# Altium project LM-003.PrjPcb (part 1 of 2)
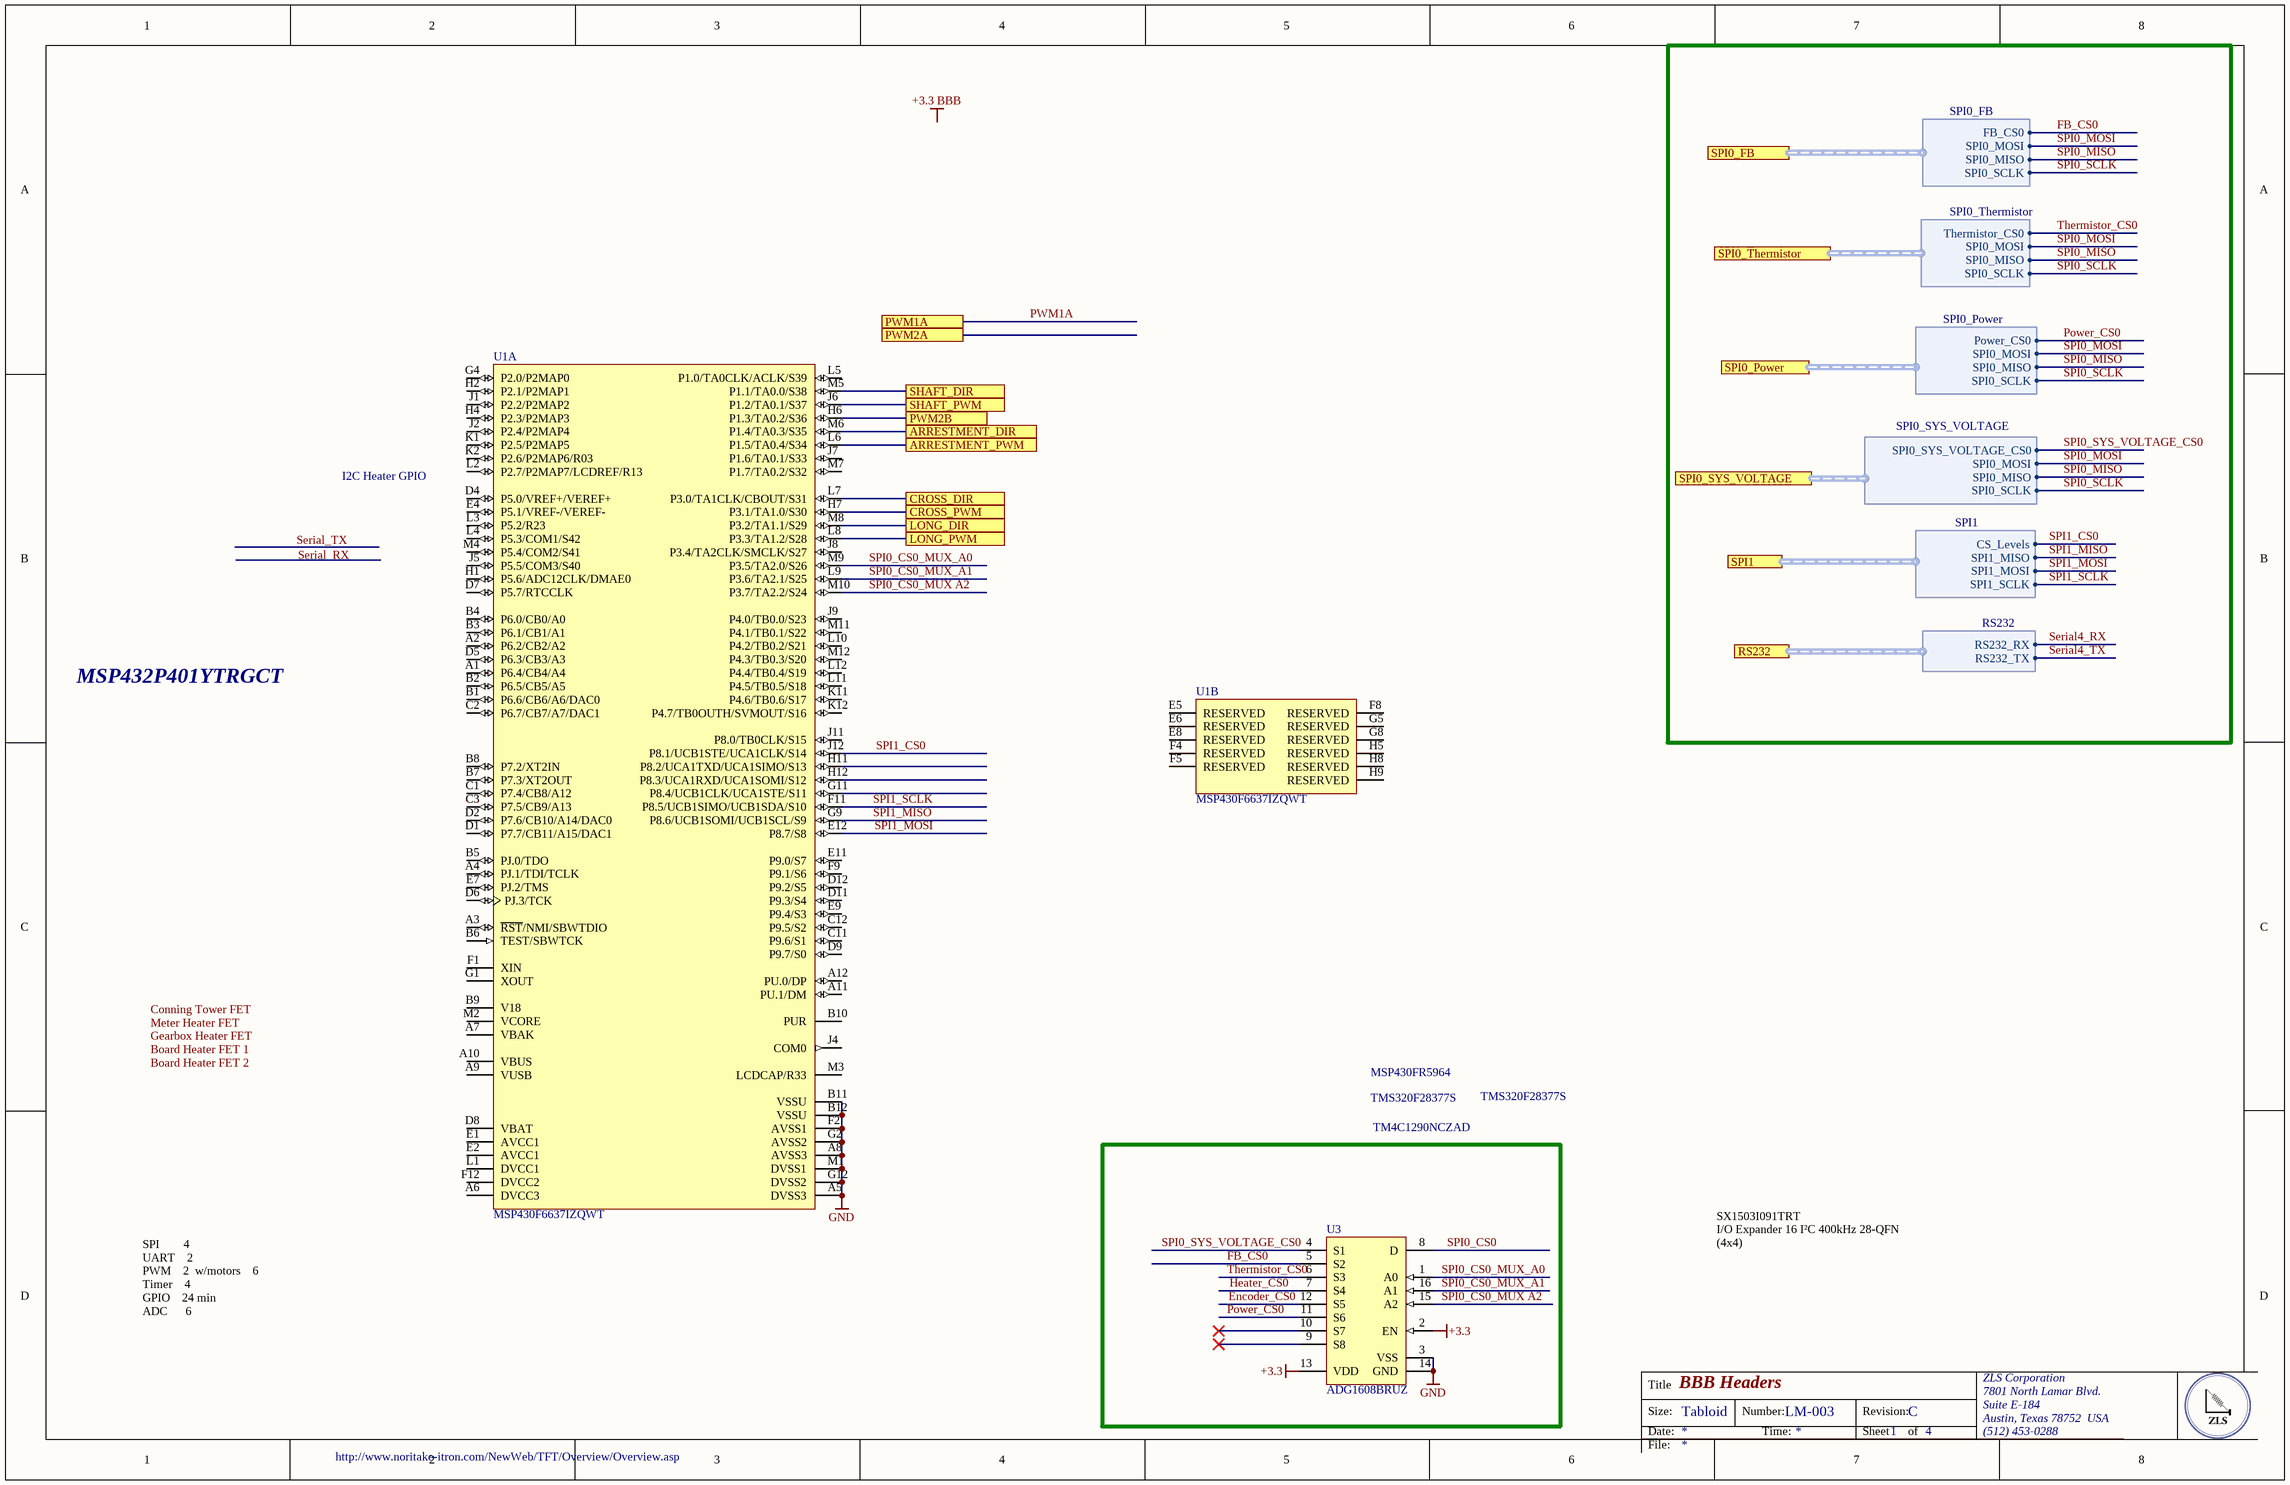
[diagram p0: MCU.SchDoc]
6 sheets, 53 parts. Net scope: flat (ports and power ports of the same name join across sheets).
Board file: LM-003.PcbDoc
Sheets:
  MCU.SchDoc
  Connectors.SchDoc
  System_Supply.SchDoc
  12_Supply.SchDoc
  36V_HV_Supply.SchDoc
  Power_Input_FET.SchDoc

## Sheet MCU.SchDoc: BBB Headers
size Tabloid; DocumentNumber: LM-003; Revision: C; SheetNumber: 1; SheetTotal: 4

### Parts
U1  MSP430F6637IZQWT  [TI-ZQW113]  (parts A,B of 2)
U3  ADG1608BRUZ  [ADI-RU-16_M]

### Blocks framed on the sheet
TM4C1290NCZAD: U3

### Ports
ARRESTMENT_DIR, ARRESTMENT_PWM, CROSS_DIR, CROSS_PWM, LONG_DIR, LONG_PWM, PWM1A, PWM2A, PWM2B, RS232 (harness RS232), SHAFT_DIR, SHAFT_PWM, SPI0_FB (harness SPI0_FB), SPI0_Power (harness SPI0_Power), SPI0_SYS_VOLTAGE (harness SPI0_SYS_VOLTAGE), SPI0_Thermistor (harness SPI0_Thermistor), SPI1 (harness SPI1)

### Harnesses
RS232: RS232_RX, RS232_TX
SPI1: CS_Levels, SPI1_MISO, SPI1_MOSI, SPI1_SCLK
SPI0_Power: Power_CS0, SPI0_MOSI, SPI0_MISO, SPI0_SCLK
SPI0_Thermistor: Thermistor_CS0, SPI0_MOSI, SPI0_MISO, SPI0_SCLK
SPI0_FB: FB_CS0, SPI0_MOSI, SPI0_MISO, SPI0_SCLK
SPI0_SYS_VOLTAGE: SPI0_SYS_VOLTAGE_CS0, SPI0_MOSI, SPI0_MISO, SPI0_SCLK

### Nets
+3.3: U3.2(EN) U3.13(VDD)
GND: U1.A5(DVSS3) U1.A8(AVSS3) U1.B11(VSSU) U1.B12(VSSU) U1.F2(AVSS1) U1.G2(AVSS2) U1.G12(DVSS2) U1.M1(DVSS1) U3.3(VSS) U3.14(GND)
Encoder_CS0: U3.12(S5)
FB_CS0: U3.5(S2) ; port SPI0_FB.FB_CS0
Heater_CS0: U3.7(S4)
Power_CS0: U3.11(S6) ; port SPI0_Power.Power_CS0
PWM2B: U1.H6(P1.3/TA0.2/S36) ; port PWM2B
Serial4_RX: port RS232.RS232_RX
Serial4_TX: port RS232.RS232_TX
SPI0_CS0: U3.8(D)
SPI0_CS0_MUX A2: U1.M10(P3.7/TA2.2/S24) U3.15(A2)
SPI0_CS0_MUX_A0: U1.M9(P3.5/TA2.0/S26) U3.1(A0)
SPI0_CS0_MUX_A1: U1.L9(P3.6/TA2.1/S25) U3.16(A1)
SPI0_MISO: port SPI0_Power.SPI0_MISO, port SPI0_Thermistor.SPI0_MISO, port SPI0_FB.SPI0_MISO, port SPI0_SYS_VOLTAGE.SPI0_MISO
SPI0_MOSI: port SPI0_Power.SPI0_MOSI, port SPI0_Thermistor.SPI0_MOSI, port SPI0_FB.SPI0_MOSI, port SPI0_SYS_VOLTAGE.SPI0_MOSI
SPI0_SCLK: port SPI0_Power.SPI0_SCLK, port SPI0_Thermistor.SPI0_SCLK, port SPI0_FB.SPI0_SCLK, port SPI0_SYS_VOLTAGE.SPI0_SCLK
SPI0_SYS_VOLTAGE_CS0: U3.4(S1) ; port SPI0_SYS_VOLTAGE.SPI0_SYS_VOLTAGE_CS0
SPI1_CS0: U1.J12(P8.1/UCB1STE/UCA1CLK/S14) ; port SPI1.CS_Levels
SPI1_MISO: U1.G9(P8.6/UCB1SOMI/UCB1SCL/S9) ; port SPI1.SPI1_MISO
SPI1_MOSI: U1.E12(P8.7/S8) ; port SPI1.SPI1_MOSI
SPI1_SCLK: U1.F11(P8.5/UCB1SIMO/UCB1SDA/S10) ; port SPI1.SPI1_SCLK
Thermistor_CS0: U3.6(S3) ; port SPI0_Thermistor.Thermistor_CS0
NetU1_H7: U1.H7(P3.1/TA1.0/S30) ; port CROSS_PWM
NetU1_J6: U1.J6(P1.2/TA0.1/S37) ; port SHAFT_PWM
NetU1_L6: U1.L6(P1.5/TA0.4/S34) ; port ARRESTMENT_PWM
NetU1_L7: U1.L7(P3.0/TA1CLK/CBOUT/S31) ; port CROSS_DIR
NetU1_L8: U1.L8(P3.3/TA1.2/S28) ; port LONG_PWM
NetU1_M5: U1.M5(P1.1/TA0.0/S38) ; port SHAFT_DIR
NetU1_M6: U1.M6(P1.4/TA0.3/S35) ; port ARRESTMENT_DIR
NetU1_M8: U1.M8(P3.2/TA1.1/S29) ; port LONG_DIR

Not connected (* = marked no-connect by the designer): U1 A1(P6.4/CB4/A4) A2(P6.2/CB2/A2) A3(~{RST}/NMI/SBWTDIO) A4(PJ.1/TDI/TCLK) A6(DVCC3) A7(VBAK) A9(VUSB) A10(VBUS) A11(PU.1/DM) A12(PU.0/DP) B1(P6.6/CB6/A6/DAC0) B2(P6.5/CB5/A5) B3(P6.1/CB1/A1) B4(P6.0/CB0/A0) B5(PJ.0/TDO) B6(TEST/SBWTCK) B7(P7.3/XT2OUT) B8(P7.2/XT2IN) B9(V18) B10(PUR) C1(P7.4/CB8/A12) C2(P6.7/CB7/A7/DAC1) C3(P7.5/CB9/A13) C11(P9.6/S1) C12(P9.5/S2) D1(P7.7/CB11/A15/DAC1) D2(P7.6/CB10/A14/DAC0) D4(P5.0/VREF+/VEREF+) D5(P6.3/CB3/A3) D6(PJ.3/TCK) D7(P5.7/RTCCLK) D8(VBAT) D9(P9.7/S0) D11(P9.3/S4) D12(P9.2/S5) E1(AVCC1) E2(AVCC1) E4(P5.1/VREF-/VEREF-) E5(RESERVED) E6(RESERVED) E7(PJ.2/TMS) E8(RESERVED) E9(P9.4/S3) E11(P9.0/S7) F1(XIN) F4(RESERVED) F5(RESERVED) F8(RESERVED) F9(P9.1/S6) F12(DVCC2) G1(XOUT) G4(P2.0/P2MAP0) G5(RESERVED) G8(RESERVED) G11(P8.4/UCB1CLK/UCA1STE/S11) H1(P5.6/ADC12CLK/DMAE0) H2(P2.1/P2MAP1) H4(P2.3/P2MAP3) H5(RESERVED) H8(RESERVED) H9(RESERVED) H11(P8.2/UCA1TXD/UCA1SIMO/S13) H12(P8.3/UCA1RXD/UCA1SOMI/S12) J1(P2.2/P2MAP2) J2(P2.4/P2MAP4) J4(COM0) J5(P5.5/COM3/S40) J7(P1.6/TA0.1/S33) J8(P3.4/TA2CLK/SMCLK/S27) J9(P4.0/TB0.0/S23) J11(P8.0/TB0CLK/S15) K1(P2.5/P2MAP5) K2(P2.6/P2MAP6/R03) K11(P4.6/TB0.6/S17) K12(P4.7/TB0OUTH/SVMOUT/S16) L1(DVCC1) L2(P2.7/P2MAP7/LCDREF/R13) L3(P5.2/R23) L4(P5.3/COM1/S42) L5(P1.0/TA0CLK/ACLK/S39) L10(P4.2/TB0.2/S21) L11(P4.5/TB0.5/S18) L12(P4.4/TB0.4/S19) M2(VCORE) M3(LCDCAP/R33) M4(P5.4/COM2/S41) M7(P1.7/TA0.2/S32) M11(P4.1/TB0.1/S22) M12(P4.3/TB0.3/S20); U3 9(S8)* 10(S7)*

### Notes on the sheet
- I2C Heater GPIO
- MSP432P401YTRGCT
- MSP430FR5964
- TMS320F28377S
- SX1503I091TRT
  I/O Expander 16 I²C 400kHz 28-QFN (4x4)
- SPI        4
  UART    2
  PWM    2  w/motors    6
  Timer    4
  GPIO    24 min
  ADC      6
- http://www.noritake-itron.com/NewWeb/TFT/Overview/Overview.asp
- Labels drawn without touching a wire or pin: +3.3 BBB, Board Heater FET 1, Board Heater FET 2, Conning Tower FET, Gearbox Heater FET, Meter Heater FET, Serial_RX, Serial_TX
- Title
- Size:
- Date:
- Tabloid
- Number:
- Time:
- Revision:
- Sheet
- of
- ZLS Corporation
- 7801 North Lamar Blvd.
- Suite E-184
- Austin, Texas 78752  USA
- (512) 453-0288
- File:

### Library data of the parts
U1 = CMP-0365-01413-1: 20 MHz Mixed Signal Microcontroller with 192 KB Flash, 16384 B SRAM and 74 GPIOs, -40 to 85 degC, 113-pin BGA (ZQW), Green (RoHS & no Sb/Br); Manufacturer: Texas Instruments; Frequency(MHz): 20; Brown Out Reset: Yes; Real-Time Clock: Yes, with battery backup; DMA: 3; ADC Channels: 16; Timers - 16-bit: 4; DAC: 2; ADC: 12-bit SAR; SRAM(B): 16384; GPIO: 74; Multiplier: 32x32; Flash(KB): 192; USB: 1; SubFamily: 6 Series with LCD; Eco-Plan: Green (RoHS & no Sb/Br); ComponentLink3URL: http://www.ti.com/lit/ml/mpbg674/mpbg674.pdf; PackageReference: ZQW113; PackageVersion: 4204599-3/D; ComponentLink2Description: Datasheet; Watchdog: Yes; ComponentLink1Description: Manufacturer URL; ComponentLink2URL: http://www.ti.com/general/docs/lit/getliterature.tsp?genericPartNumber=MSP430F6637&fileType=pdf; PartNumber: MSP430F6637IZQWT; Temp Sensor: Yes; Code_JEDEC: MO-225; USCI_B (I2C & SPI): 2; ComponentLink1URL: http://www.ti.com/; SVS: Yes; DatasheetVersion: SLAS566C; ComponentLink3Description: Package Specification; PackageDescription: 113-Pin Plastic Ball Grid Array Package, Body 7 x 7 mm, Pitch 0.5 mm; USCI_A (UART/LIN/IrDA/SPI): 2; Mounting Technology: Surface Mount; Comparators: Yes; PartId: 1
U3 = CMP-0793-00136-1: 4.5 Ohm Ron, 8-Channel +/-5 V,+12 V, +5 V and +3.3 V Multiplexer, 16-pin SOP (RU-16), Tube; Manufacturer: Analog Devices Inc.; Multiplexer/Demultiplexer Circuit: 8:1; On-State Resistance (Max): 4.5 Ohm; Channel-to-Channel Matching (&Delta;Ron): 120 mOhm; Voltage - Supply, Single (V+): 3.3 V ~ 16 V; Voltage - Supply, Dual (V±): ±3.3 V ~ 8 V; Switch Time (Ton, Toff) (Max): 94ns, 93ns; -3db Bandwidth: 40MHz; Charge Injection: 29pC; Channel Capacitance (CS(off), CD(off)): 19pF, 117pF; Current - Leakage (IS(off)) (Max): 100pA; Crosstalk: -64dB @ 1MHz; Supplier 1: Digi-Key; Supplier Part Number 1: ADG1608BRUZ-ND; Manufacturer Part Number: ADG1608BRUZ; RoHS: RoHS Compliant; Category: Integrated Circuits (ICs); Stock 1: 1151; Pricing 1: 1=9.31, 96=8.01552, 192=6.95979, 576=6.0605 (USD); Packaging: Tube; Part Status: Active; Switch Circuit: -; Operating Temperature: -40°C ~ 125°C (TA); Package / Case: 16-TSSOP (0.173", 4.40mm Width); Supplier Device Package: 16-TSSOP; Base Part Number: ADG1608; ComponentLink1URL: http://www.analog.com/media/en/technical-documentation/data-sheets/ADG1608_1609.pdf; ComponentLink1Description: http://www.analog.com/media/en/technical-documentation/data-sheets/ADG1608_1609.pdf

## Sheet Connectors.SchDoc: Connectors
size OrCAD A; DocumentNumber: LM-003; Revision: C; SheetNumber: 2; SheetTotal: 4
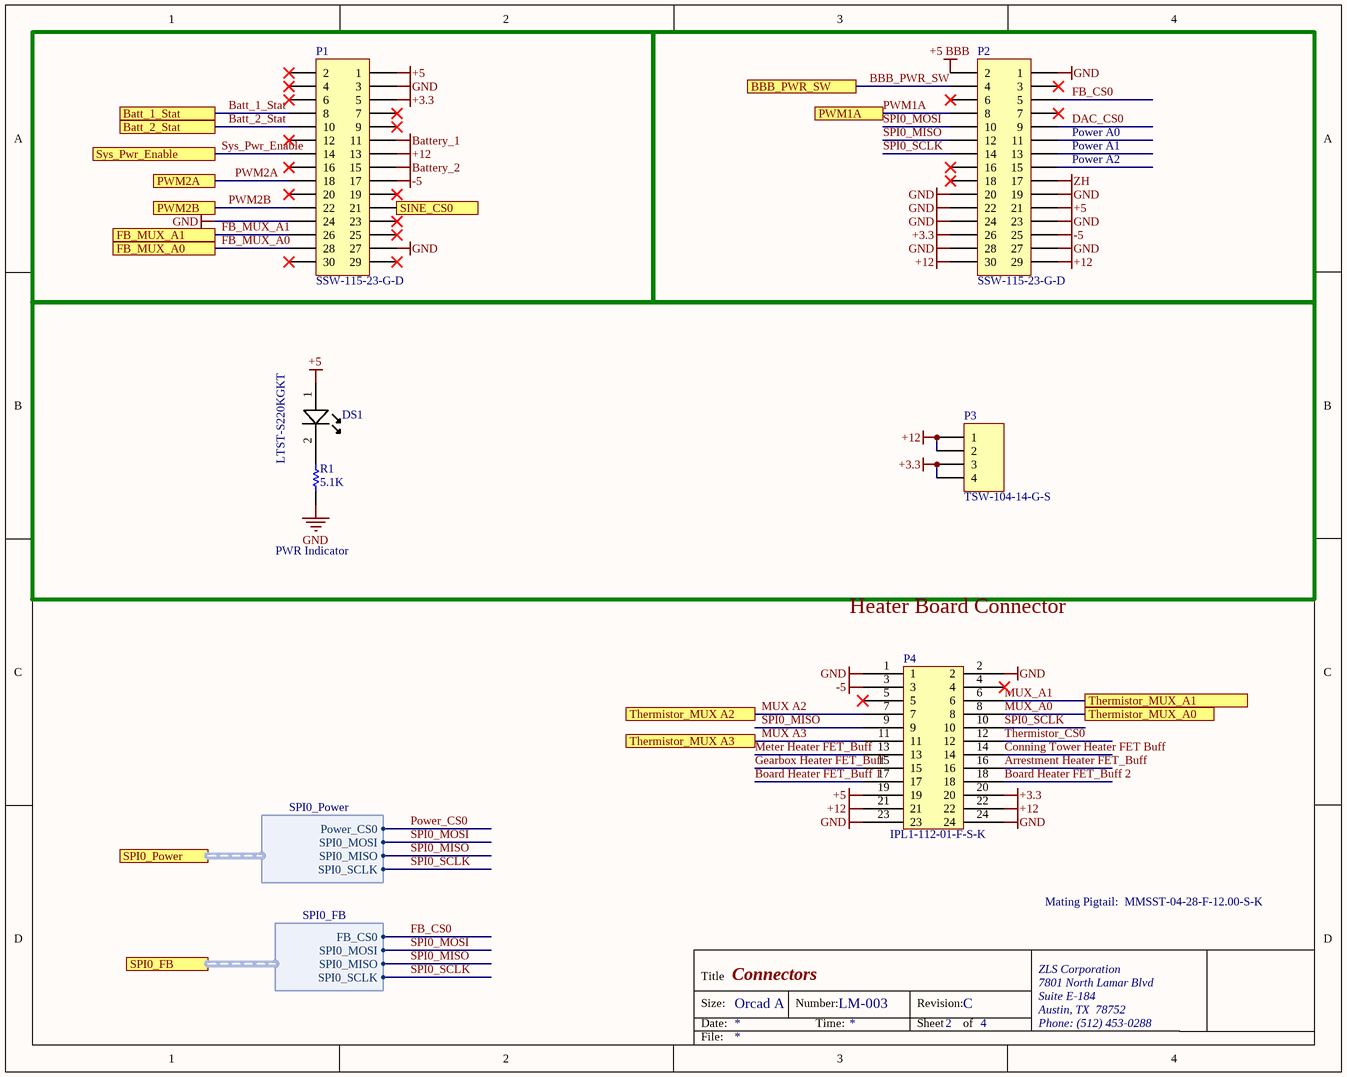
[diagram p1: Connectors.SchDoc]

### Parts
DS1  Manufacturer Part Number: LTST-S220KGKT  [0805C_L]  (hidden comment: Lite-On LTST-S220KGKT Green LED, 571 nm 2012 (0805) Side View, Rectangle Lens SMD package)
P1  SSW-115-23-G-D  [SSW-115-23-G-D]
P2  SSW-115-23-G-D  [SSW-115-23-G-D]
P3  TSW-104-14-G-S  [HDR1X4]
P4  IPL1-112-01-F-S-K  [IPL1-112-01-F-S-K]
R1  5.1K  [RESC0805(2012)_L]

### Blocks framed on the sheet
PWR Indicator: DS1 P3 R1

### Ports
Batt_1_Stat, Batt_2_Stat, BBB_PWR_SW, FB_MUX_A0, FB_MUX_A1, PWM1A, PWM2A, PWM2B, SINE_CS0, SPI0_FB (harness SPI0_FB), SPI0_Power (harness SPI0_Power), Sys_Pwr_Enable, Thermistor_MUX A2, Thermistor_MUX A3, Thermistor_MUX_A0, Thermistor_MUX_A1

### Harnesses
SPI0_FB: FB_CS0, SPI0_MOSI, SPI0_MISO, SPI0_SCLK
SPI0_Power: Power_CS0, SPI0_MOSI, SPI0_MISO, SPI0_SCLK

### Nets
+3.3: P1.5 P2.26 P3.3 P3.4 P4.20
+5: DS1.1(A) P1.1 P2.21 P4.19
+5 BBB: P2.2
+12: P1.13 P2.29 P2.30 P3.1 P3.2 P4.21 P4.22
-5: P1.17 P2.25 P4.3
Battery_1: P1.11
Battery_2: P1.15
GND: P1.3 P1.24 P1.27 P2.1 P2.19 P2.20 P2.22 P2.23 P2.24 P2.27 P2.28 P4.1 P4.2 P4.23 P4.24 R1.2
ZH: P2.17
Arrestment Heater FET_Buff: P4.16
Batt_1_Stat: P1.8 ; port Batt_1_Stat
Batt_2_Stat: P1.10 ; port Batt_2_Stat
BBB_PWR_SW: P2.4 ; port BBB_PWR_SW
Board Heater FET_Buff 1: P4.17
Board Heater FET_Buff 2: P4.18
Conning Tower Heater FET Buff: P4.14
DAC_CS0: P2.9
FB_CS0: P2.5 ; port SPI0_FB.FB_CS0
FB_MUX_A0: P1.28 ; port FB_MUX_A0
FB_MUX_A1: P1.26 ; port FB_MUX_A1
Gearbox Heater FET_Buff: P4.15
Meter Heater FET_Buff: P4.13
MUX A2: P4.7 ; port Thermistor_MUX A2
MUX A3: P4.11 ; port Thermistor_MUX A3
MUX_A0: P4.8 ; port Thermistor_MUX_A0
MUX_A1: P4.6 ; port Thermistor_MUX_A1
PWM1A: P2.8 ; port PWM1A
PWM2A: P1.18 ; port PWM2A
PWM2B: P1.22 ; port PWM2B
SPI0_MISO: P2.12 P4.9 ; port SPI0_FB.SPI0_MISO, port SPI0_Power.SPI0_MISO
SPI0_MOSI: P2.10 ; port SPI0_FB.SPI0_MOSI, port SPI0_Power.SPI0_MOSI
SPI0_SCLK: P2.14 P4.10 ; port SPI0_FB.SPI0_SCLK, port SPI0_Power.SPI0_SCLK
Sys_Pwr_Enable: P1.14 ; port Sys_Pwr_Enable
Thermistor_CS0: P4.12
NetDS1_2: DS1.2(K) R1.1
NetP1_21: P1.21 ; port SINE_CS0

Not connected (* = marked no-connect by the designer): P1 2* 4* 6* 7* 9* 12* 16* 19* 20* 23* 25* 29* 30*; P2 3* 6* 7* 11 13 15 16* 18*; P4 4* 5*

### Notes on the sheet
- (near P2) Power A0
- (near P2) Power A1
- (near P2) Power A2
- Heater Board Connector
- Mating Pigtail:  MMSST-04-28-F-12.00-S-K
- Title
- Size:
- Date:
- Orcad A
- Number:
- Time:
- Revision:
- Sheet
- of
- ZLS Corporation
- 7801 North Lamar Blvd
- Suite E-184
- Austin, TX  78752
- Phone: (512) 453-0288
- File:

### Library data of the parts
DS1 = LED A/K: Manufacturer: Vishay / Lite-On; Lens Colour: Colorless; Viewing Angle: 130°; Luminous Intensity: 35mcd; Forward Current: 20mA; Forward Voltage: 2V; Lens Style: Diffused,Colorless; Power Rating: 75mW; Dominant Wavelength: 568nm; Lens Transparency: Clear; Number of Elements: 1; Power Dissipation: 75W; Wavelength: 574nm; Supplier 1: Digi-Key; Supplier Part Number 1: 160-1468-1-ND; Stock 1: 74800; Pricing 1: 1=0.29, 10=0.212, 25=0.1564, 100=0.1117, 250=0.0759, 500=0.067, 1000=0.0525 (USD); Mount: Surface Mount; Case/Package: 0805; Number of Pins: 2; Colour: Green; Case Code (Metric): 2012; Case Code (Imperial): 0805; Min Operating Temperature: -55°C; Max Operating Temperature: 85°C; Packaging: Tape and Reel; Package Quantity: 4000; Illumination Colour: Green; Test Current: 20mA; Number of LEDs: 1; Length: 2.1mm; Height: 0.6mm; Width: 1mm; Depth: 0.6mm; Radiation Hardening: No; Lead Free: Lead Free; ComponentLink1URL: https://datasheet.ciiva.com/11775/0900766b80dc0b70-11775441.pdf; ComponentLink1Description: https://datasheet.ciiva.com/11775/0900766b80dc0b70-11775441.pdf; ComponentLink2URL: https://datasheet.ciiva.com/2110/s-110-ltst-s220kgkt-2110069.pdf; ComponentLink2Description: https://datasheet.ciiva.com/2110/s-110-ltst-s220kgkt-2110069.pdf; ComponentLink3URL: https://datasheet.ciiva.com/2110/s-110-ltst-s220kgkt-2110070.pdf; ComponentLink3Description: https://datasheet.ciiva.com/2110/s-110-ltst-s220kgkt-2110070.pdf; ComponentLink4URL: https://datasheet.ciiva.com/12400/100-ltst-s220kgkt-59602-12400886.pdf; ComponentLink4Description: https://datasheet.ciiva.com/12400/100-ltst-s220kgkt-59602-12400886.pdf; ComponentLink5URL: https://datasheet.ciiva.com/2110/s-110-ltst-s220kgkt-2110071.pdf; ComponentLink5Description: https://datasheet.ciiva.com/2110/s-110-ltst-s220kgkt-2110071.pdf; ComponentLink6URL: https://datasheet.ciiva.com/16379/ltst-s220kgkt-16379082.pdf; ComponentLink6Description: https://datasheet.ciiva.com/16379/ltst-s220kgkt-16379082.pdf
P1 P2 = Header 15X2: Header, 15-Pin, Dual row; Manufacturer: Samtec Inc.; Connector Type: Receptacle; Style: Board to Board or Cable; Number of Positions: 30; Number of Positions Loaded: All; Pitch - Mating: 0.100" (2.54mm); Contact Length - Post: 0.394" (10.00mm); Material Flammability Rating: UL94 V-0; Current Rating: 5.7A per Contact; Supplier 1: Digi-Key; Supplier Part Number 1: SSW-115-23-G-D-ND; Manufacturer Part Number: SSW-115-23-G-D; RoHS: RoHS Compliant; Category: Connectors, Interconnects; Stock 1: 0; Pricing 1: 1=5.3 (USD); Packaging: Bulk; Part Status: Active; Contact Type: Forked; Row Spacing - Mating: 0.100" (2.54mm); Mounting Type: Through Hole; Termination: Solder; Fastening Type: Push-Pull; Contact Finish - Mating: Gold; Contact Finish Thickness - Mating: 20.0µin (0.51µm); Insulation Color: Black; Insulation Height: 0.335" (8.51mm); Operating Temperature: -55°C ~ 125°C; Contact Finish - Post: Gold; Mated Stacking Heights: -; Ingress Protection: -; Features: -; Voltage Rating: -; Applications: -; Insulation Material: Liquid Crystal Polymer (LCP); Contact Shape: Square; Contact Material: Phosphor Bronze; Contact Finish Thickness - Post: 3.00µin (0.076µm)
P3 = Header 4: Header, 4-Pin; Manufacturer: Samtec Inc.; Pitch - Mating: 0.100" (2.54mm); Number of Positions: 4; Number of Positions Loaded: All; Style: Board to Board or Cable; Shrouding: Unshrouded; Contact Length - Mating: 0.320" (8.13mm); Contact Length - Post: 0.110" (2.79mm); Overall Contact Length: 0.530" (13.46mm); Material Flammability Rating: UL94 V-0; Supplier 1: Digi-Key; Supplier Part Number 1: SAM1053-04-ND; Manufacturer Part Number: TSW-104-14-G-S; RoHS: RoHS Compliant; Category: Connectors, Interconnects; Stock 1: 278; Pricing 1: 1=1.02, 10=0.915, 100=0.7537, 500=0.59578, 1000=0.51143, 5000=0.46657, 10000=0.44863 (USD); Packaging: Bulk; Part Status: Active; Connector Type: Header; Contact Type: Male Pin; Number of Rows: 1; Row Spacing - Mating: -; Mounting Type: Through Hole; Termination: Solder; Fastening Type: Push-Pull; Insulation Height: 0.100" (2.54mm); Contact Shape: Square; Contact Finish - Mating: Gold; Contact Finish Thickness - Mating: 10.0µin (0.25µm); Contact Finish - Post: Gold; Contact Material: Phosphor Bronze; Insulation Material: Polybutylene Terephthalate (PBT); Features: -; Operating Temperature: -55°C ~ 125°C; Ingress Protection: -; Insulation Color: Black; Current Rating: -; Voltage Rating: -; Mated Stacking Heights: -; Contact Finish Thickness - Post: 3.00µin (0.076µm); Applications: -; ComponentLink1URL: http://suddendocs.samtec.com/prints/tsw-xxx-xx-xxx-x-xx-xxx-mkt.pdf; ComponentLink1Description: http://suddendocs.samtec.com/prints/tsw-xxx-xx-xxx-x-xx-xxx-mkt.pdf
P4 = IPL1-112-01-F-S-K: IPL1-112-01-F-D-K; Manufacturer: Samtec Inc.; Supplier 1: Digi-Key; Supplier Part Number 1: IPL1-112-01-F-S-K-ND; Manufacturer Part Number: IPL1-112-01-F-S-K; RoHS: RoHS Compliant; Category: Connectors, Interconnects; Stock 1: 0; Pricing 1: 1=2.63 (USD); Part Status: Active
R1 = CMP-1013-00215-1: RES SMD 5.1K OHM 5% 1/8W 0805; Manufacturer: Vishay Dale; Manufacturer Part Number: CRCW08055K10JNEA; Power (Watts): 0.125W, 1/8W; Temperature Coefficient: ±200ppm/°C; Supplier 1: Digi-Key; Supplier Part Number 1: 541-5.1KACT-ND; RoHS: RoHS Compliant; Category: Resistors; Stock 1: 429; Pricing 1: 1=0.1, 10=0.044, 100=0.0178, 1000=0.00802, 2500=0.00696 (USD); Packaging: Cut Tape (CT); Part Status: Active; Tolerance: ±5%; Composition: Thick Film; Features: Automotive AEC-Q200; Operating Temperature: -55°C ~ 155°C; Package / Case: 0805 (2012 Metric); Supplier Device Package: 0805; Size / Dimension: 0.079" L x 0.049" W (2.00mm x 1.25mm); Height - Seated (Max): 0.020" (0.50mm); Failure Rate: -; ComponentLink1URL: http://www.vishay.com/docs/20035/dcrcwe3.pdf; ComponentLink1Description: http://www.vishay.com/docs/20035/dcrcwe3.pdf

## Sheet System_Supply.SchDoc
size OrCAD A
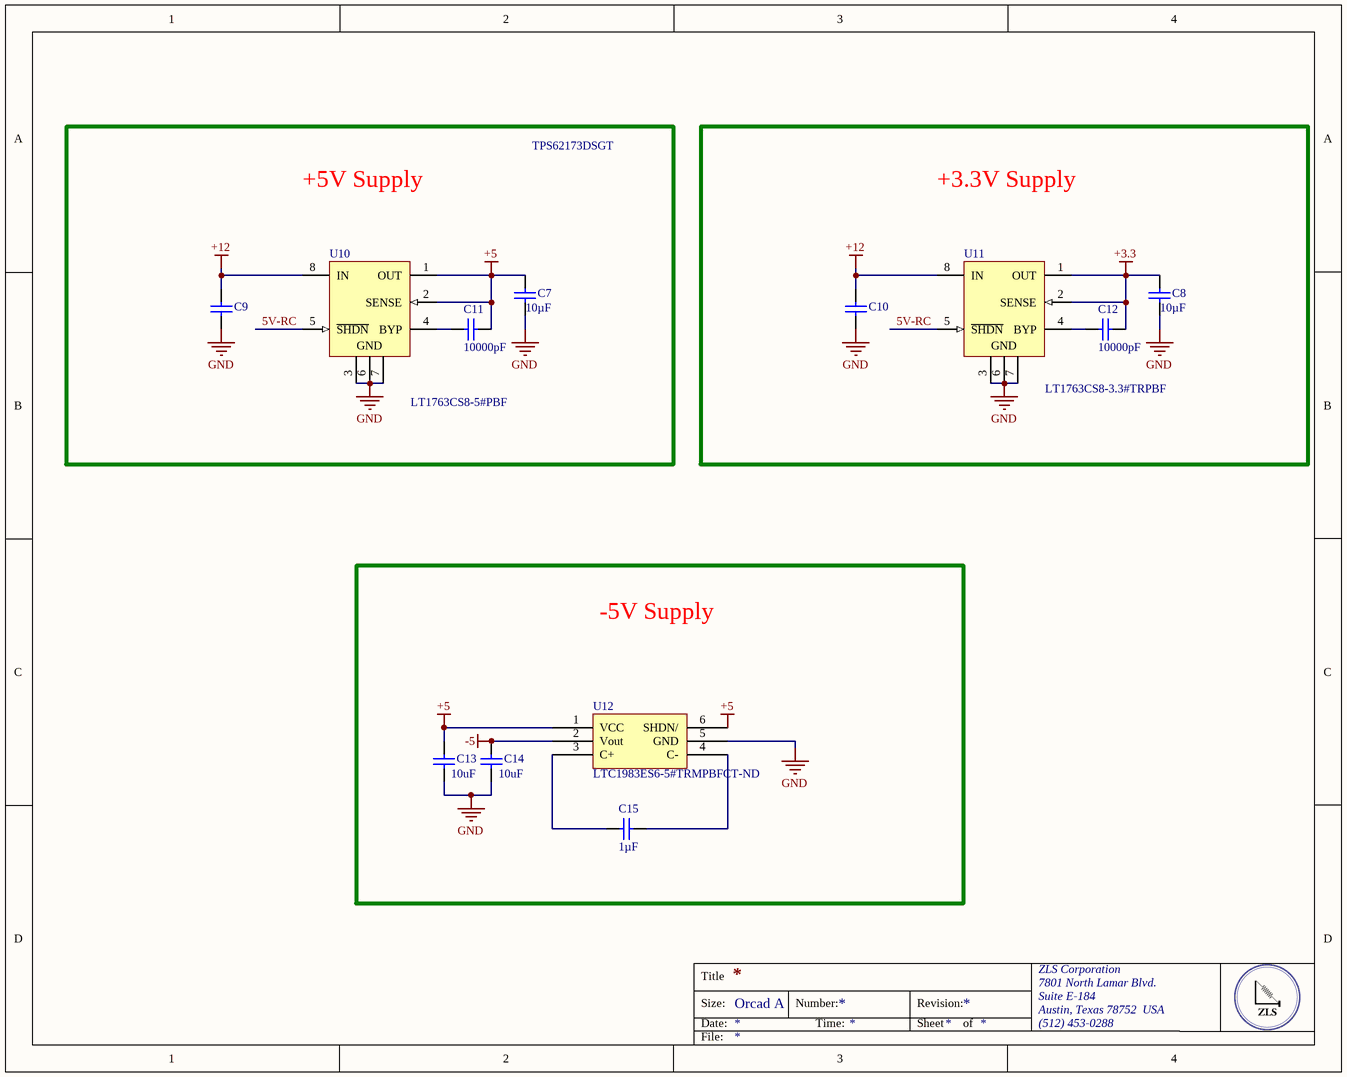
[diagram p2: System_Supply.SchDoc]

### Parts
C7  Capacitance: 10µF  [CAPC1206(3216)130_N]  (hidden comment: CAP CER 1UF 50V X7R 1210)
C8  Capacitance: 10µF  [CAPC1206(3216)130_N]  (hidden comment: CAP CER 1UF 50V X7R 1210)
C9  1uF  [CAPC1206(3216)130_N]  (value not drawn)
C10  1uF  [CAPC1206(3216)130_N]  (value not drawn)
C11  Capacitance: 10000pF  [CAPC1206(3216)130_N]  (hidden comment: CAP CER 1UF 50V X7R 1210)
C12  Capacitance: 10000pF  [CAPC1206(3216)130_N]  (hidden comment: CAP CER 1UF 50V X7R 1210)
C13  Capacitance: 10uF  [CAPC1206(3216)130_N]  (hidden comment: CAP CER 10UF 6.3V X5R 1206)
C14  Capacitance: 10uF  [CAPC1206(3216)130_N]  (hidden comment: CAP CER 10UF 6.3V X5R 1206)
C15  Capacitance: 1µF  [CAPC1206(3216)130_N]  (hidden comment: CAP CER 1UF 10V X5R 0805)
U10  LT1763CS8-5#PBF  [LT-S8-8_M]
U11  LT1763CS8-3.3#TRPBF  [LT-S8-8_N]
U12  Supplier Part Number 1: LTC1983ES6-5#TRMPBFCT-ND  [SOT95P323X100-6N]  (hidden comment: LTC1983ES6-5#TRMPBF)

### Blocks framed on the sheet
+5V Supply: C7 C9 C11 U10
+3.3V Supply: C8 C10 C12 U11
-5V Supply: C13-C15 U12

### Nets
+3.3: C8.2 C12.1 U11.1(OUT) U11.2(SENSE)
+5: C7.2 C11.1 C13.2 U10.1(OUT) U10.2(SENSE) U12.1(VCC) U12.6(SHDN/)
+12: C9.2 C10.2 U10.8(IN) U11.8(IN)
-5: C14.2 U12.2(Vout)
GND: C7.1 C8.1 C9.1 C10.1 C13.1 C14.1 U10.3(GND) U10.6(GND) U10.7(GND) U11.3(GND) U11.6(GND) U11.7(GND) U12.5(GND)
5V-RC: U10.5(~{SHDN}) U11.5(~{SHDN})
NetC11_2: C11.2 U10.4(BYP)
NetC12_2: C12.2 U11.4(BYP)
NetC15_1: C15.1 U12.4(C-)
NetC15_2: C15.2 U12.3(C+)

### Notes on the sheet
- TPS62173DSGT
- Title
- Size:
- Date:
- Orcad A
- Number:
- Time:
- Revision:
- Sheet
- of
- ZLS Corporation
- 7801 North Lamar Blvd.
- Suite E-184
- Austin, Texas 78752  USA
- (512) 453-0288
- File:

### Library data of the parts
C7 C8 C11 C12 = CMP-1037-04913-1: Manufacturer: Murata Electronics North America; Manufacturer Part Number: GRM32RR71H105KA01L; Tolerance: ±10%; Supplier 1: Digi-Key; Supplier Part Number 1: 490-1863-6-ND; RoHS: RoHS Compliant; Category: Capacitors; Stock 1: 66890; Pricing 1: 1=0.35, 10=0.242, 100=0.1449, 500=0.10868 (USD); Packaging: Digi-Reel®; Part Status: Active; Voltage - Rated: 50V; Temperature Coefficient: X7R; Operating Temperature: -55°C ~ 125°C; Features: -; Ratings: -; Applications: General Purpose; Mounting Type: Surface Mount, MLCC; Package / Case: 1210 (3225 Metric); Size / Dimension: 0.126" L x 0.098" W (3.20mm x 2.50mm); Height - Seated (Max): -; Thickness (Max): 0.079" (2.00mm); Lead Spacing: -; Lead Style: -; ComponentLink1URL: http://search.murata.co.jp/Ceramy/image/img/A01X/G101/ENG/GRM32RR71H105KA01-01.pdf; ComponentLink1Description: http://search.murata.co.jp/Ceramy/image/img/A01X/G101/ENG/GRM32RR71H105KA01-01.pdf
C9 C10 = CMP-1037-04913-1
C13 C14 = CMP-1037-04913-1: Manufacturer: Taiyo Yuden; Manufacturer Part Number: JMK316BJ106ML-T; Tolerance: ±20%; Notification: Current market demand for these product types have resulted in fluctuating and extending lead times. Lead times may differ.; Supplier 1: Digi-Key; Supplier Part Number 1: 587-5447-1-ND; RoHS: RoHS Compliant; Category: Capacitors; Stock 1: 5600; Pricing 1: 1=0.24, 10=0.161, 100=0.0817, 500=0.05592, 1000=0.04946 (USD); Packaging: Cut Tape (CT); Part Status: Active; Voltage - Rated: 6.3V; Temperature Coefficient: X5R; Operating Temperature: -55°C ~ 85°C; Features: -; Ratings: -; Applications: SMPS Filtering; Failure Rate: -; Mounting Type: Surface Mount, MLCC; Package / Case: 1206 (3216 Metric); Size / Dimension: 0.126" L x 0.063" W (3.20mm x 1.60mm); Height - Seated (Max): -; Thickness (Max): 0.071" (1.80mm); Lead Spacing: -; Lead Style: -; ComponentLink1URL: http://ds.yuden.co.jp/TYCOMPAS/ut/detail.do?productNo=JMK316BJ106ML-T&fileName=JMK316BJ106ML-T_SS&mode=specSheetDownload; ComponentLink1Description: http://ds.yuden.co.jp/TYCOMPAS/ut/detail.do?productNo=JMK316BJ106ML-T&fileName=JMK316BJ106ML-T_SS&mode=specSheetDownload
C15 = CMP-1037-04913-1: Manufacturer: Taiyo Yuden; Manufacturer Part Number: LMK212BJ105MD-T; Tolerance: ±20%; Notification: Current market demand for these product types have resulted in fluctuating and extending lead times. Lead times may differ.; Supplier 1: Digi-Key; Supplier Part Number 1: 587-4918-1-ND; RoHS: RoHS Compliant; Category: Capacitors; Stock 1: 2994; Pricing 1: 1=0.17, 10=0.121, 100=0.0567, 500=0.03976, 1000=0.03291 (USD); Packaging: Cut Tape (CT); Part Status: Active; Voltage - Rated: 10V; Temperature Coefficient: X5R; Operating Temperature: -55°C ~ 85°C; Features: -; Ratings: -; Applications: SMPS Filtering; Failure Rate: -; Mounting Type: Surface Mount, MLCC; Package / Case: 0805 (2012 Metric); Size / Dimension: 0.079" L x 0.049" W (2.00mm x 1.25mm); Height - Seated (Max): -; Thickness (Max): 0.037" (0.95mm); Lead Spacing: -; Lead Style: -; ComponentLink1URL: http://ds.yuden.co.jp/TYCOMPAS/ut/detail.do?productNo=LMK212BJ105MD-T&fileName=LMK212BJ105MD-T_SS&mode=specSheetDownload; ComponentLink1Description: http://ds.yuden.co.jp/TYCOMPAS/ut/detail.do?productNo=LMK212BJ105MD-T&fileName=LMK212BJ105MD-T_SS&mode=specSheetDownload
U10 = CMP-0476-01685-1: 500 mA, Low Noise, LDO Micropower Regulator, 1.8 to 20 V Vin, 5 V Vout, 8-pin SOIC (S8-8), -40 to 125 degC, Pb-Free; Manufacturer: Linear Technology; Output Voltage: 5 V; Vin Min(V): 1.8; Discrete Pass Element: no; Number of Outputs: 1; Dropout Voltage(V): 0.3; Vin Max(V): 20; PSRR(dB): 65; Iout(mA): 500; Isupply(mA): 0.03; Mounting Technology: Surface Mount; ComponentLink3Description: Package Specification; PartNumber: LT1763CS8-5#PBF; PackageDescription: 8-Pin Plastic Small Outline (Narrow .150 Inch), Body 4.9 x 3.9 mm, Pitch 1.27 mm; DatasheetVersion: Rev. G; ComponentLink2URL: http://cds.linear.com/docs/en/datasheet/1763fg.pdf; PackageReference: S8-8; ComponentLink1URL: http://www.linear.com/; ComponentLink2Description: Datasheet; ComponentLink1Description: Manufacturer URL; PackageVersion: Rev. G, 03/2012; Shutdown Current(uA): 1; ComponentLink3URL: http://cds.linear.com/docs/en/packaging/05081610_G_SO8.pdf; RoHS: TRUE; Noise(uV): 20
U11 = CMP-0476-01686-1: 500 mA, Low Noise, LDO Micropower Regulator, 1.8 to 20 V Vin, 3.3 V Vout, 8-pin SOIC (S8-8), -40 to 125 degC, Pb-Free, Tape and Reel; Manufacturer: Linear Technology; Isupply(mA): 0.03; Iout(mA): 500; Discrete Pass Element: no; Vin Max(V): 20; Dropout Voltage(V): 0.3; Output Voltage: 3.3 V; Shutdown Current(uA): 1; Vin Min(V): 1.8; PSRR(dB): 65; Mounting Technology: Surface Mount; DatasheetVersion: Rev. G; ComponentLink1URL: http://www.linear.com/; ComponentLink3URL: http://cds.linear.com/docs/en/packaging/05081610_G_SO8.pdf; ComponentLink1Description: Manufacturer URL; Noise(uV): 20; PackageReference: S8-8; ComponentLink2Description: Datasheet; PackageDescription: 8-Pin Plastic Small Outline (Narrow .150 Inch), Body 4.9 x 3.9 mm, Pitch 1.27 mm; Number of Outputs: 1; PackageVersion: Rev. G, 03/2012; RoHS: TRUE; ComponentLink3Description: Package Specification; ComponentLink2URL: http://cds.linear.com/docs/en/datasheet/1763fg.pdf; PartNumber: LT1763CS8-3.3#TRPBF; Packing: Tape and Reel
U12 = LTC1983ES6-5#TRMPBF: Manufacturer: Linear Technology/Analog Devices; Function: Step-Down; Output Configuration: Negative; Topology: Charge Pump; Output Type: Fixed; Number of Outputs: 1; Voltage - Input (Min): 2.3V; Voltage - Input (Max): 5.5V; Voltage - Output (Min/Fixed): -5V; Current - Output: 100mA; Frequency - Switching: 900kHz; Synchronous Rectifier: No; Supplier 1: Digi-Key; Manufacturer Part Number: LTC1983ES6-5#TRMPBF; RoHS: RoHS Compliant; Category: Integrated Circuits (ICs); Stock 1: 17516; Pricing 1: 1=4.36, 25=3.8952, 100=2.3256, 250=2.1318 (USD); Packaging: Cut Tape (CT); Part Status: Active; Voltage - Output (Max): -; Operating Temperature: -40°C ~ 85°C (TA); Mounting Type: Surface Mount; Package / Case: SOT-23-6 Thin, TSOT-23-6; Supplier Device Package: TSOT-23-6; Base Part Number: LTC1983-5; ComponentLink1URL: http://www.linear.com/docs/2135; ComponentLink1Description: http://www.linear.com/docs/2135

## Sheet 12_Supply.SchDoc: 12V Supply
size Tabloid; DocumentNumber: LM-008; Revision: B; SheetNumber: 4; SheetTotal: 7
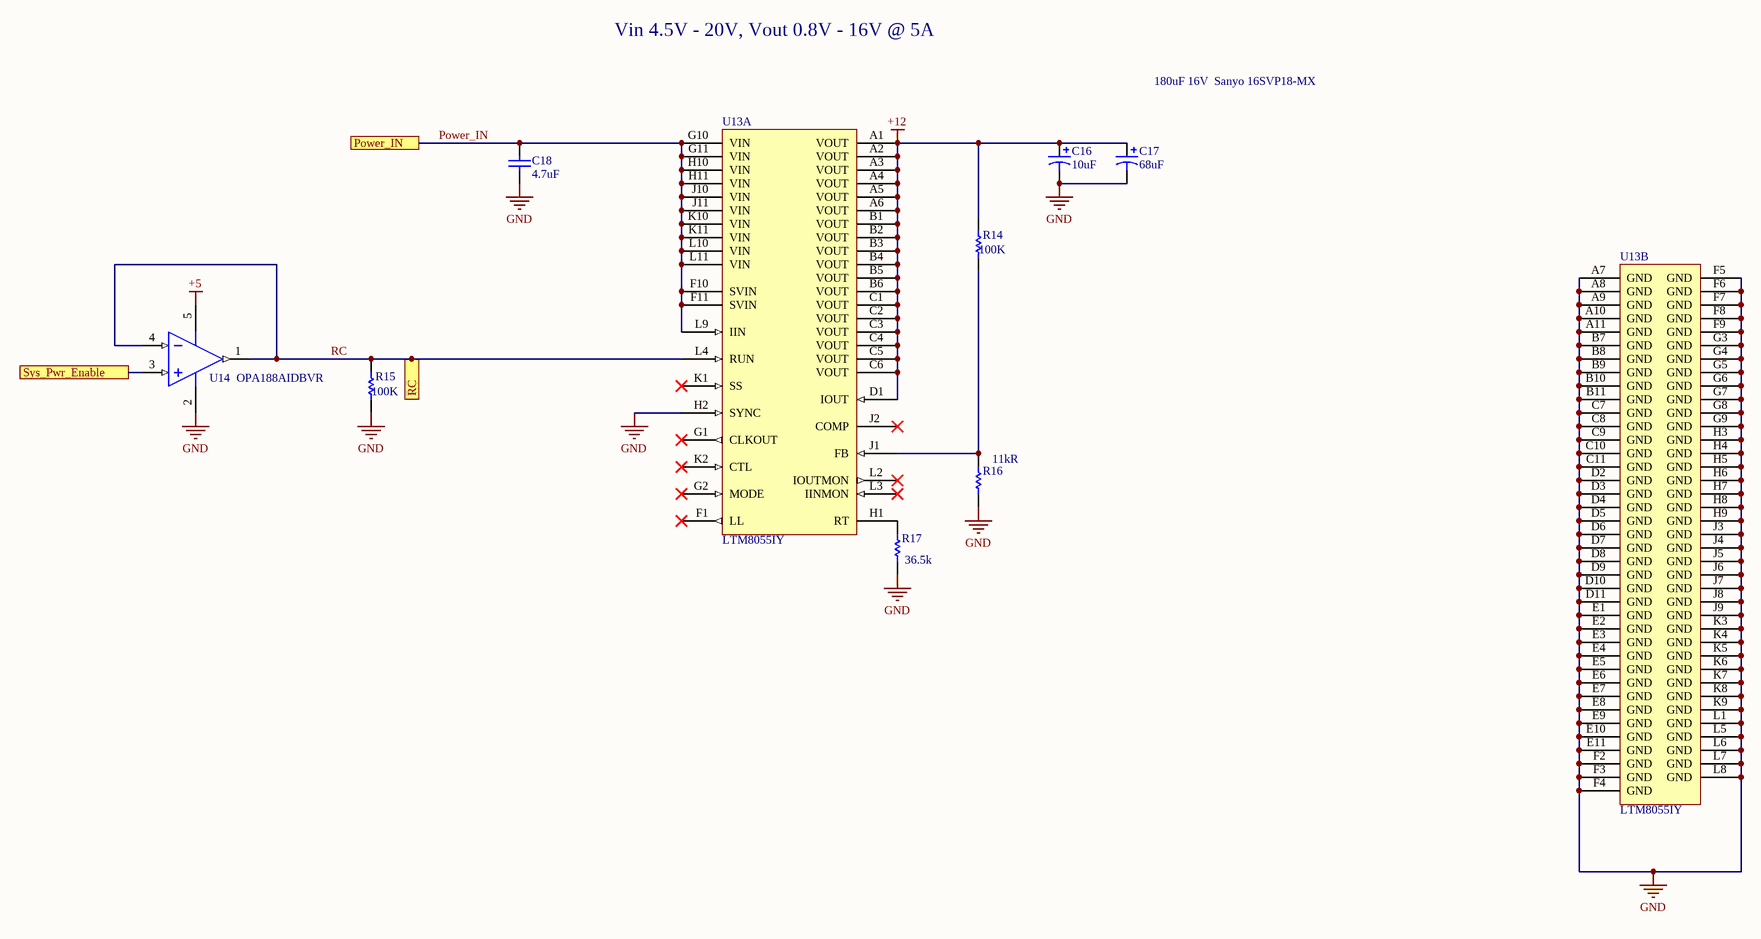
[diagram p3: 12_Supply.SchDoc]

### Parts
C16  10uF  [C0805]
C17  68uF  [AVX-CAPC7343_V]
C18  4.7uF  [CAPC1210(3225)100_M]
R14  Resistance: 100K  [RESC0805(2012)_M]  (hidden comment: RES SMD 100K OHM 1% 1/8W 0805)
R15  Resistance: 100K  [RESC0805(2012)_M]  (hidden comment: RES SMD 100K OHM 1% 1/8W 0805)
R16  Resistance: 11kR  [RESC0805(2012)_M]  (hidden comment: RES SMD 11K OHM 1% 1/8W 0805)
R17  Resistance: 36.5k  [RESC0805(2012)_M]  (hidden comment: RES SMD 35K OHM 1% 1/8W 0805)
U13  LTM8055IY  [LT-BGA-121-15000X15000X4920]  (parts A,B of 2)
U14  OPA188AIDBVR  [DBV0005A_M]

### Ports
Power_IN, RC, Sys_Pwr_Enable

### Nets
+5: U14.5(V+)
+12: C16.1 C17.1 R14.1 U13.A1(VOUT) U13.A2(VOUT) U13.A3(VOUT) U13.A4(VOUT) U13.A5(VOUT) U13.A6(VOUT) U13.B1(VOUT) U13.B2(VOUT) U13.B3(VOUT) U13.B4(VOUT) U13.B5(VOUT) U13.B6(VOUT) U13.C1(VOUT) U13.C2(VOUT) U13.C3(VOUT) U13.C4(VOUT) U13.C5(VOUT) U13.C6(VOUT) U13.D1(IOUT)
GND: C16.2 C17.2 C18.1 R15.2 R16.2 R17.2 U13.A7(GND) U13.A8(GND) U13.A9(GND) U13.A10(GND) U13.A11(GND) U13.B7(GND) U13.B8(GND) U13.B9(GND) U13.B10(GND) U13.B11(GND) U13.C7(GND) U13.C8(GND) U13.C9(GND) U13.C10(GND) U13.C11(GND) U13.D2(GND) U13.D3(GND) U13.D4(GND) U13.D5(GND) U13.D6(GND) U13.D7(GND) U13.D8(GND) U13.D9(GND) U13.D10(GND) U13.D11(GND) U13.E1(GND) U13.E2(GND) U13.E3(GND) U13.E4(GND) U13.E5(GND) U13.E6(GND) U13.E7(GND) U13.E8(GND) U13.E9(GND) U13.E10(GND) U13.E11(GND) U13.F2(GND) U13.F3(GND) U13.F4(GND) U13.F5(GND) U13.F6(GND) U13.F7(GND) U13.F8(GND) U13.F9(GND) U13.G3(GND) U13.G4(GND) U13.G5(GND) U13.G6(GND) U13.G7(GND) U13.G8(GND) U13.G9(GND) U13.H2(SYNC) U13.H3(GND) U13.H4(GND) U13.H5(GND) U13.H6(GND) U13.H7(GND) U13.H8(GND) U13.H9(GND) U13.J3(GND) U13.J4(GND) U13.J5(GND) U13.J6(GND) U13.J7(GND) U13.J8(GND) U13.J9(GND) U13.K3(GND) U13.K4(GND) U13.K5(GND) U13.K6(GND) U13.K7(GND) U13.K8(GND) U13.K9(GND) U13.L1(GND) U13.L5(GND) U13.L6(GND) U13.L7(GND) U13.L8(GND) U14.2(V-)
Power_IN: C18.2 U13.F10(SVIN) U13.F11(SVIN) U13.G10(VIN) U13.G11(VIN) U13.H10(VIN) U13.H11(VIN) U13.J10(VIN) U13.J11(VIN) U13.K10(VIN) U13.K11(VIN) U13.L9(IIN) U13.L10(VIN) U13.L11(VIN) ; port Power_IN
RC: R15.1 U13.L4(RUN) U14.1(OUT) U14.4(IN-) ; port RC
Sys_Pwr_Enable: U14.3(IN+) ; port Sys_Pwr_Enable
NetR14_2: R14.2 R16.1 U13.J1(FB)
NetR17_1: R17.1 U13.H1(RT)

Not connected (* = marked no-connect by the designer): U13 F1(LL)* G1(CLKOUT)* G2(MODE)* J2(COMP)* K1(SS)* K2(CTL)* L2(IOUTMON)* L3(IINMON)*

### Notes on the sheet
- Vin 4.5V - 20V, Vout 0.8V - 16V @ 5A
- 180uF 16V  Sanyo 16SVP18-MX
- Title
- Size:
- Date:
- Tabloid
- Number:
- Time:
- Revision:
- Sheet
- of
- ZLS Corporation
- 7801 North Lamar Blvd.
- Suite E-184
- Austin, Texas 78752  USA
- (512) 453-0288
- File:

### Library data of the parts
C16 = Cap Pol3: Polarized Capacitor (Surface Mount)
C17 = CMP-0279-00002-2: CAP TANT POLY 68UF 25V 2917; Manufacturer: Kyocera AVX; Manufacturer Part Number: TCJE686M025R0050; Tolerance: 20%; ESR (Equivalent Series Resistance): 50mR; Leakage Current: 170uA; Life (Hours): 2000Hour; Dissipation Factor: 6%; ComponentLink2Description: Datasheet; ComponentLink2URL: http://www.avx.com/docs/Catalogs/taj.pdf; ComponentLink1URL: http://www.avx.com/; ComponentLink1Description: Manufacturer URL; Supplier 1: Digi-Key; Supplier Part Number 1: 478-9471-6-ND; Stock 1: 439; Pricing 1: 1=3.92, 10=3.163, 100=2.4672 (USD); Mount: Surface Mount; Case/Package: 2917; Case Code (Imperial): 2917; Case Code (Metric): 7343; Min Operating Temperature: -55°C; Max Operating Temperature: 105°C; Capacitance: 68uF; Voltage Rating: 25V; Packaging: Tape and Reel; Package Quantity: 400; Voltage Rating (DC): 25V; Termination: SMD/SMT; Features: General Purpose; Length: 7.3mm; Height: 4.3mm; Width: 0.169inch; Height - Seated (Max): 0.169inch; Depth: 4.3mm; Radiation Hardening: No; ComponentLink3URL: http://www.avx.com/docs/catalogs/tcj.pdf?src-supplier=Avnet; ComponentLink3Description: http://www.avx.com/docs/catalogs/tcj.pdf?src-supplier=Avnet
C18 = CMP-1038-00619-1: CAP CER 4.7UF 50V X7R 1210; Manufacturer: Murata; Manufacturer Part Number: GCM32ER71H475KA55K; Tolerance: 10%; Supplier 1: Digi-Key; Supplier Part Number 1: 490-8066-6-ND; Stock 1: 63504; Pricing 1: 1=1.8, 10=1.424, 100=1.0676, 500=0.80666, 1000=0.71177 (USD); Mount: Surface Mount; Case/Package: 1210; Case Code (Metric): 3225; Case Code (Imperial): 1210; Min Operating Temperature: -55°C; Max Operating Temperature: 125°C; Capacitance: 4.7uF; Packaging: Tape and Reel; Package Quantity: 1; Voltage Rating: 50V; Voltage Rating (DC): 50V; Dielectric: X7R; Termination: SMD/SMT; Length: 3.2mm; Height: 2.5mm; Width: 0.098inch; Thickness: 0.106inch; Depth: 2.5mm; Ratings: AEC-Q200; Radiation Hardening: No; ComponentLink1URL: http://search.murata.co.jp/Ceramy/image/img/A01X/partnumbering_e_02.pdf?src-supplier=Digi-Key; ComponentLink1Description: http://search.murata.co.jp/Ceramy/image/img/A01X/partnumbering_e_02.pdf?src-supplier=Digi-Key; ComponentLink2URL: http://psearch.en.murata.com/capacitor/product/GCM32ER71H475KA55%23.pdf?src-supplier=Digi-Key; ComponentLink2Description: http://psearch.en.murata.com/capacitor/product/GCM32ER71H475KA55%23.pdf?src-supplier=Digi-Key; ComponentLink3URL: http://psearch.murata.com/capacitor/product/GCM32ER71H475KA55%23.pdf?src-supplier=Avnet; ComponentLink3Description: http://psearch.murata.com/capacitor/product/GCM32ER71H475KA55%23.pdf?src-supplier=Avnet
R14 R15 = CMP-1013-00017-1: Manufacturer: Vishay; Manufacturer Part Number: CRCW0805100KFKEA; Temperature Coefficient: 100ppm/°C; Power Rating: 125mW; Voltage Rating: 150V; Supplier 1: Avnet; Supplier Part Number 1: CRCW0805100KFKEA/BKN; Stock 1: 1317; Pricing 1: 1=0.1, 10=0.049, 25=0.042, 50=0.035, 100=0.028 (USD); Mount: Surface Mount; Case/Package: 0805; Number of Pins: 2; Weight: 0.000194oz; Contact Plating: Tin; Case Code (Imperial): 0805; Case Code (Metric): 2012; Min Operating Temperature: -55°C; Max Operating Temperature: 155°C; Tolerance: 1%; Composition: Thick Film; Termination: SMD/SMT; Packaging: Tape and Reel; Package Quantity: 5000; Military Standard: Not; Voltage Rating (DC): 150V; Length: 2mm; Height: 0.45mm; Width: 1.25mm; Depth: 1.25mm; Radiation Hardening: No; Lead Free: Lead Free; REACH SVHC: Unknown; ComponentLink1URL: https://datasheet.ciiva.com/11809/0900766b80d98b26-11809057.pdf; ComponentLink1Description: https://datasheet.ciiva.com/11809/0900766b80d98b26-11809057.pdf; ComponentLink2URL: https://datasheet.ciiva.com/7777/1697337-7777349.pdf; ComponentLink2Description: https://datasheet.ciiva.com/7777/1697337-7777349.pdf; ComponentLink3URL: https://datasheet.ciiva.com/3258/dcrcwe3-3258006.pdf; ComponentLink3Description: https://datasheet.ciiva.com/3258/dcrcwe3-3258006.pdf; ComponentLink4URL: https://datasheet.ciiva.com/16754/70201119-16754822.pdf; ComponentLink4Description: https://datasheet.ciiva.com/16754/70201119-16754822.pdf; ComponentLink5URL: https://datasheet.ciiva.com/8337/dcrcwe3-8337738.pdf; ComponentLink5Description: https://datasheet.ciiva.com/8337/dcrcwe3-8337738.pdf; ComponentLink6URL: https://datasheet.ciiva.com/16341/dcrcwe3-16341530.pdf; ComponentLink6Description: https://datasheet.ciiva.com/16341/dcrcwe3-16341530.pdf; ComponentLink7URL: https://datasheet.ciiva.com/16852/dcrcwe3-16852810.pdf; ComponentLink7Description: https://datasheet.ciiva.com/16852/dcrcwe3-16852810.pdf; ComponentLink8URL: https://datasheet.ciiva.com/16720/70201119-16720891.pdf; ComponentLink8Description: https://datasheet.ciiva.com/16720/70201119-16720891.pdf; ComponentLink9URL: https://datasheet.ciiva.com/7777/1720486-7777565.pdf; ComponentLink9Description: https://datasheet.ciiva.com/7777/1720486-7777565.pdf
R16 = CMP-1013-00017-1: Manufacturer: TE Connectivity Holsworthy; Manufacturer Part Number: CRG0805F11K; Temperature Coefficient: 100ppm/°C; Power Rating: 125mW; Voltage Rating: 150V; Number of Resistors: 1; ComponentLink1URL: https://datasheet.ciiva.com/11809/0900766b80d98b26-11809057.pdf; ComponentLink1Description: https://datasheet.ciiva.com/11809/0900766b80d98b26-11809057.pdf; ComponentLink2URL: https://datasheet.ciiva.com/7777/1697337-7777349.pdf; ComponentLink2Description: https://datasheet.ciiva.com/7777/1697337-7777349.pdf; ComponentLink3URL: https://datasheet.ciiva.com/3258/dcrcwe3-3258006.pdf; ComponentLink3Description: https://datasheet.ciiva.com/3258/dcrcwe3-3258006.pdf; ComponentLink4URL: https://datasheet.ciiva.com/16754/70201119-16754822.pdf; ComponentLink4Description: https://datasheet.ciiva.com/16754/70201119-16754822.pdf; ComponentLink5URL: https://datasheet.ciiva.com/8337/dcrcwe3-8337738.pdf; ComponentLink5Description: https://datasheet.ciiva.com/8337/dcrcwe3-8337738.pdf; ComponentLink6URL: https://datasheet.ciiva.com/16341/dcrcwe3-16341530.pdf; ComponentLink6Description: https://datasheet.ciiva.com/16341/dcrcwe3-16341530.pdf; ComponentLink7URL: https://datasheet.ciiva.com/16852/dcrcwe3-16852810.pdf; ComponentLink7Description: https://datasheet.ciiva.com/16852/dcrcwe3-16852810.pdf; ComponentLink8URL: https://datasheet.ciiva.com/16720/70201119-16720891.pdf; ComponentLink8Description: https://datasheet.ciiva.com/16720/70201119-16720891.pdf; ComponentLink9URL: https://datasheet.ciiva.com/7777/1720486-7777565.pdf; ComponentLink9Description: https://datasheet.ciiva.com/7777/1720486-7777565.pdf; Supplier 1: Digikey; Supplier Part Number 1: A126334DKR-ND; Stock 1: 142510; Pricing 1: 1=0.1, 10=0.052, 100=0.021, 1000=0.00943, 2500=0.00819 (USD); Mount: Surface Mount; Case/Package: 0805; Weight: 0.000194oz; Case Code (Imperial): 0805; Case Code (Metric): 2012; Min Operating Temperature: -55°C; Max Operating Temperature: 125°C; Tolerance: 1%; Packaging: Tape and Reel; Composition: Thick Film; Package Quantity: 5000; Number of Terminations: 2; Termination: Solder; Length: 2mm; Height: 0.55mm; Width: 1.25mm; ELV: Compliant; ComponentLink10URL: http://www.mouser.com/ds/2/418/NG_CD_1623104_BA-655654.pdf?src-supplier=Mouser; ComponentLink10Description: http://www.mouser.com/ds/2/418/NG_CD_1623104_BA-655654.pdf?src-supplier=Mouser
R17 = CMP-1013-00017-1: Manufacturer: Vishay; Manufacturer Part Number: CRCW080536K5FKEA; Temperature Coefficient: 100ppm/°C; Max Power Dissipation: 125mW; Voltage Rating: 150V; ComponentLink1URL: https://datasheet.ciiva.com/11809/0900766b80d98b26-11809057.pdf; ComponentLink1Description: https://datasheet.ciiva.com/11809/0900766b80d98b26-11809057.pdf; ComponentLink2URL: https://datasheet.ciiva.com/7777/1697337-7777349.pdf; ComponentLink2Description: https://datasheet.ciiva.com/7777/1697337-7777349.pdf; ComponentLink3URL: https://datasheet.ciiva.com/3258/dcrcwe3-3258006.pdf; ComponentLink3Description: https://datasheet.ciiva.com/3258/dcrcwe3-3258006.pdf; ComponentLink4URL: https://datasheet.ciiva.com/16754/70201119-16754822.pdf; ComponentLink4Description: https://datasheet.ciiva.com/16754/70201119-16754822.pdf; ComponentLink5URL: https://datasheet.ciiva.com/8337/dcrcwe3-8337738.pdf; ComponentLink5Description: https://datasheet.ciiva.com/8337/dcrcwe3-8337738.pdf; ComponentLink6URL: https://datasheet.ciiva.com/16341/dcrcwe3-16341530.pdf; ComponentLink6Description: https://datasheet.ciiva.com/16341/dcrcwe3-16341530.pdf; ComponentLink7URL: https://datasheet.ciiva.com/16852/dcrcwe3-16852810.pdf; ComponentLink7Description: https://datasheet.ciiva.com/16852/dcrcwe3-16852810.pdf; ComponentLink8URL: https://datasheet.ciiva.com/16720/70201119-16720891.pdf; ComponentLink8Description: https://datasheet.ciiva.com/16720/70201119-16720891.pdf; ComponentLink9URL: https://datasheet.ciiva.com/7777/1720486-7777565.pdf; ComponentLink9Description: https://datasheet.ciiva.com/7777/1720486-7777565.pdf; ComponentLink10URL: http://www.mouser.com/ds/2/418/NG_CD_1623104_BA-655654.pdf?src-supplier=Mouser; ComponentLink10Description: http://www.mouser.com/ds/2/418/NG_CD_1623104_BA-655654.pdf?src-supplier=Mouser; Supplier 1: Digi-Key; Supplier Part Number 1: 541-36.5KCDKR-ND; Stock 1: 56622; Pricing 1: 1=0.1, 10=0.069, 100=0.028, 1000=0.01256, 2500=0.0109 (USD); Case/Package: 0805; Number of Pins: 2; Weight: 0.000194oz; Contact Plating: Tin; Case Code (Imperial): 0805; Case Code (Metric): 2012; Min Operating Temperature: -55°C; Max Operating Temperature: 155°C; Tolerance: 1%; Composition: Thick Film; Packaging: Tape and Reel; Package Quantity: 10; Number of Terminations: 2; Features: Automotive AEC-Q200; Power Rating: 125mW; Military Standard: Not; Termination: SMD/SMT; Length: 2mm; Height: 0.45mm; Width: 1.25mm; Depth: 1.25mm; Radiation Hardening: No; REACH SVHC: Unknown; ComponentLink11URL: http://uk.rs-online.com/webdocs/0d98/0900766b80d98b26.pdf?src-supplier=RSComponents; ComponentLink11Description: http://uk.rs-online.com/webdocs/0d98/0900766b80d98b26.pdf?src-supplier=RSComponents; ComponentLink12URL: https://www.verical.com/server-webapp/html/getDatasheet?partID=32738&src-supplier=Verical; ComponentLink12Description: https://www.verical.com/server-webapp/html/getDatasheet?partID=32738&src-supplier=Verical; ComponentLink13URL: http://www.farnell.com/datasheets/1697337.pdf?src-supplier=Farnell; ComponentLink13Description: http://www.farnell.com/datasheets/1697337.pdf?src-supplier=Farnell; ComponentLink14URL: http://www.vishay.com/docs/20035/dcrcwe3.pdf?src-supplier=Avnet; ComponentLink14Description: http://www.vishay.com/docs/20035/dcrcwe3.pdf?src-supplier=Avnet; ComponentLink15URL: http://www.farnell.com/datasheets/2111203.pdf?src-supplier=Element14; ComponentLink15Description: http://www.farnell.com/datasheets/2111203.pdf?src-supplier=Element14; ComponentLink16URL: https://www.alliedelec.com/m/d/0c934d6939ccefa68dbe0b96d821c8cf.pdf?src-supplier=Allied+Electronics; ComponentLink16Description: https://www.alliedelec.com/m/d/0c934d6939ccefa68dbe0b96d821c8cf.pdf?src-supplier=Allied+Electronics; ComponentLink17URL: http://www.vishay.com/docs/20035/dcrcwe3.pdf?src-supplier=Digi-Key; ComponentLink17Description: http://www.vishay.com/docs/20035/dcrcwe3.pdf?src-supplier=Digi-Key; ComponentLink18URL: http://www.farnell.com/datasheets/2049244.pdf?src-supplier=Element14; ComponentLink18Description: http://www.farnell.com/datasheets/2049244.pdf?src-supplier=Element14; ComponentLink19URL: http://www.vishay.com/docs/20035/dcrcwe3.pdf?src-supplier=Avnet+Europe; ComponentLink19Description: http://www.vishay.com/docs/20035/dcrcwe3.pdf?src-supplier=Avnet+Europe
U13 = CMP-2000-06614-1: Buck-Boost uModule Regulator, 8.5 A, 5 to 36 V, -40 to 125 degC, 121-Ball BGA, RoHS, Tray; Manufacturer: LinearTechnology; Current - Output (Max): 8.5A; Number of Outputs: 1; Efficiency: 97.5%; Voltage - Input (Max): 36V; Package Version: Rev. A, 11/2012; Voltage - Output 1: 1.2~36V; Voltage - Input (Min): 5V; Operating Temperature: -40°C~125°C; Voltage - Output 3: -; Datasheet Version: Rev. A, 01/2016; Power (Watts) - Manufacture Series: -; Series: µModule®; Manufacturer URL: http://www.linear.com/; Datasheet URL: http://cds.linear.com/docs/en/datasheet/8055fa.pdf; Type: Non-IsolatedPoLModule; Voltage - Output 2: -; Mounting Type: SurfaceMount; Packaging: Tray; Mounting Technology: SurfaceMount; Package URL: http://www.linear.com/docs/41075; Features: OTP; Power (Watts) - Max: -; Package Reference: BGA-121; Category: PowerSupplies-BoardMount; Package / Case: 121-BGA; Voltage - Isolation: -; Package Description: 121-Ball BGA, Body 15 x 15 mm, Pitch 1.27 mm; Applications: ITE(Commercial); Family: DCDCConverters; PartId: 1
U14 = CMP-0809-00005-2: Precision, Low Noise, Rail-to-Rail Output, Zero-Drift Operational Amplifier, 4 to 36 V, -40 to 125 degC, 5-pin SOT23 (DBV5), Green (RoHS & no Sb/Br); Manufacturer: Texas Instruments; Slew Rate: 0.8 V/µs; Current - Supply: 450µA; Voltage - Supply, Single/Dual (±): 4 V ~ 36 V, ±2 V ~ 18 V; Supplier 1: Digi-Key; Supplier Part Number 1: 296-40438-1-ND; Manufacturer Part Number: OPA188AIDBVR; RoHS: RoHS Compliant; Category: Integrated Circuits (ICs); Stock 1: 1779; Pricing 1: 1=2.46, 10=2.211, 100=1.7771, 500=1.46002, 1000=1.20974 (USD); Packaging: Cut Tape (CT); Part Status: Active; Amplifier Type: Zero-Drift; Output Type: Rail-to-Rail; Operating Temperature: -40°C ~ 125°C; Mounting Type: Surface Mount; Package / Case: SC-74A, SOT-753; Supplier Device Package: SOT-23-5; ComponentLink1URL: http://www.ti.com/lit/ds/symlink/opa188.pdf; ComponentLink1Description: http://www.ti.com/lit/ds/symlink/opa188.pdf

## Sheet 36V_HV_Supply.SchDoc
size Tabloid; Organization: Altium Limited; Address1: L3, 12a Rodborough Rd; Address2: Frenchs Forest; Address3: NSW; Address4: Australia 2086
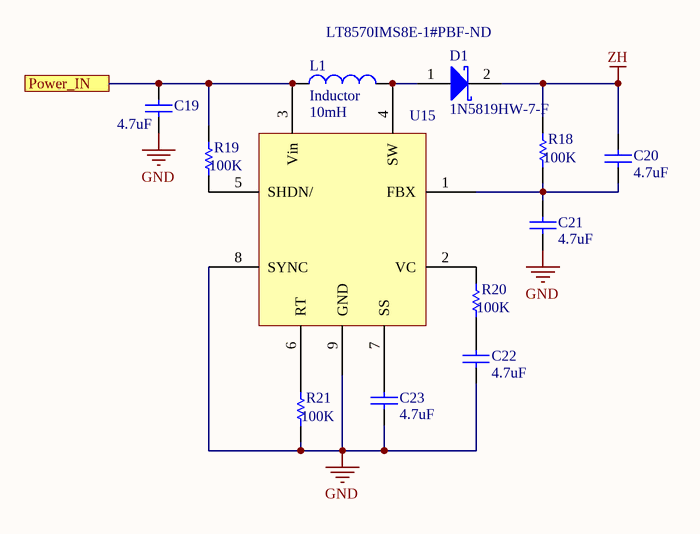
[diagram p4: 36V_HV_Supply.SchDoc]

### Parts
C19  4.7uF  [CAPC1210(3225)100_M]
C20  4.7uF  [CAPC1210(3225)100_M]
C21  4.7uF  [CAPC1210(3225)100_M]
C22  4.7uF  [CAPC1210(3225)100_M]
C23  4.7uF  [CAPC1210(3225)100_M]
D1  1N5819HW-7-F  [DIOD-SOD-123-2_V]
L1  Inductor  value 10mH  [0402-A]
R18  Resistance: 100K  [RESC0805(2012)_M]  (hidden comment: RES SMD 100K OHM 1% 1/8W 0805)
R19  Resistance: 100K  [RESC0805(2012)_M]  (hidden comment: RES SMD 100K OHM 1% 1/8W 0805)
R20  Resistance: 100K  [RESC0805(2012)_M]  (hidden comment: RES SMD 100K OHM 1% 1/8W 0805)
R21  Resistance: 100K  [RESC0805(2012)_M]  (hidden comment: RES SMD 100K OHM 1% 1/8W 0805)
U15  Supplier Part Number 1: LT8570IMS8E-1#PBF-ND  [LT8570-MSOP]  (hidden comment: LT8570)

### Ports
Power_IN

### Nets
GND: C19.1 C21.1 C22.1 C23.1 R21.2 U15.8(SYNC) U15.9(GND)
ZH: C20.2 D1.2(K) R18.1
Power_IN: C19.2 L1.1 R19.1 U15.3(Vin) ; port Power_IN
NetC20_1: C20.1 C21.2 R18.2 U15.1(FBX)
NetC22_2: C22.2 R20.2
NetC23_2: C23.2 U15.7(SS)
NetD1_1: D1.1(A) L1.2 U15.4(SW)
NetR19_2: R19.2 U15.5(SHDN/)
NetR20_1: R20.1 U15.2(VC)
NetR21_1: R21.1 U15.6(RT)

### Notes on the sheet
- Title
- Size:
- Date:
- Tabloid
- Number:
- Time:
- Revision:
- Sheet
- of
- File:

### Library data of the parts
C19-C23 = CMP-1038-00619-1: as C18 on sheet 12_Supply; Supplier 1: Digi-Key; Supplier Part Number 1: 490-8066-6-ND; Stock 1: 63504; Pricing 1: 1=1.8, 10=1.424, 100=1.0676, 500=0.80666, 1000=0.71177 (USD); Mount: Surface Mount; Case/Package: 1210; Case Code (Metric): 3225; Case Code (Imperial): 1210; Min Operating Temperature: -55°C; Max Operating Temperature: 125°C; Capacitance: 4.7uF; Packaging: Tape and Reel; Package Quantity: 1; Voltage Rating: 50V; Voltage Rating (DC): 50V; Dielectric: X7R; Termination: SMD/SMT; Length: 3.2mm; Height: 2.5mm; Width: 0.098inch; Thickness: 0.106inch; Depth: 2.5mm; Ratings: AEC-Q200; Radiation Hardening: No; ComponentLink1URL: http://search.murata.co.jp/Ceramy/image/img/A01X/partnumbering_e_02.pdf?src-supplier=Digi-Key; ComponentLink1Description: http://search.murata.co.jp/Ceramy/image/img/A01X/partnumbering_e_02.pdf?src-supplier=Digi-Key; ComponentLink2URL: http://psearch.en.murata.com/capacitor/product/GCM32ER71H475KA55%23.pdf?src-supplier=Digi-Key; ComponentLink2Description: http://psearch.en.murata.com/capacitor/product/GCM32ER71H475KA55%23.pdf?src-supplier=Digi-Key; ComponentLink3URL: http://psearch.murata.com/capacitor/product/GCM32ER71H475KA55%23.pdf?src-supplier=Avnet; ComponentLink3Description: http://psearch.murata.com/capacitor/product/GCM32ER71H475KA55%23.pdf?src-supplier=Avnet
D1 = CMP-0303-00003-1: 1.0 A Surface Mount Schottky Barrier Rectifier, 40 V, -65 to 125 degC, 2-Pin SOD-123 Package, RoHS, Tape and Reel; Manufacturer: Diodes Inc; @ VR (V): 40; @ Terminal Temperature TT (degC): 90; Maximum Average Rectified Current IO (A): 1; Total Capacitance CT (pF): 50; Peak Forward Surge Current IFSM (A): 25; Forward Voltage Drop VF (V): 0.45; VR (RMS) (V): 28; RoHS: TRUE; PartNumber: 1N5819HW-7-F; ComponentLink2URL: http://www.diodes.com/datasheets/ds30217.pdf; PackageDescription: 2-Pin SOD-123, Body 2.7 x 1.55 mm, Pitch 3.7 mm; @ IF (A): 1; Operating and Storage Temperature Range: -65 to 125 degC; ComponentLink1Description: Manufacturer URL; ComponentLink2Description: Datasheet; ComponentLink1URL: http://www.diodes.com/; Mounting Technology: Surface Mount; DatasheetVersion: Rev. 15-2; PackageReference: SOD-123-2; Maximum Reverse Current IR (uA): 50; Peak Repetitive Reverse Voltage VRRM (V): 40; Packing: Tape and Reel
L1 = Inductor: Code_IEC: 1005; Published: 8-Jun-2000; LatestRevisionDate: 29-May-2009; LatestRevisionNote: IPC-7351 Footprint Added.; PackageReference: 0402-A; Publisher: Altium Limited; PackageDescription: Chip Inductor; Code_JEITA: 0402
R18-R21 = CMP-1013-00017-1: as R14 on sheet 12_Supply; Supplier 1: Avnet; Supplier Part Number 1: CRCW0805100KFKEA/BKN; Stock 1: 1317; Pricing 1: 1=0.1, 10=0.049, 25=0.042, 50=0.035, 100=0.028 (USD); Mount: Surface Mount; Case/Package: 0805; Number of Pins: 2; Weight: 0.000194oz; Contact Plating: Tin; Case Code (Imperial): 0805; Case Code (Metric): 2012; Min Operating Temperature: -55°C; Max Operating Temperature: 155°C; Tolerance: 1%; Composition: Thick Film; Termination: SMD/SMT; Packaging: Tape and Reel; Package Quantity: 5000; Military Standard: Not; Voltage Rating (DC): 150V; Length: 2mm; Height: 0.45mm; Width: 1.25mm; Depth: 1.25mm; Radiation Hardening: No; Lead Free: Lead Free; REACH SVHC: Unknown; ComponentLink1URL: https://datasheet.ciiva.com/11809/0900766b80d98b26-11809057.pdf; ComponentLink1Description: https://datasheet.ciiva.com/11809/0900766b80d98b26-11809057.pdf; ComponentLink2URL: https://datasheet.ciiva.com/7777/1697337-7777349.pdf; ComponentLink2Description: https://datasheet.ciiva.com/7777/1697337-7777349.pdf; ComponentLink3URL: https://datasheet.ciiva.com/3258/dcrcwe3-3258006.pdf; ComponentLink3Description: https://datasheet.ciiva.com/3258/dcrcwe3-3258006.pdf; ComponentLink4URL: https://datasheet.ciiva.com/16754/70201119-16754822.pdf; ComponentLink4Description: https://datasheet.ciiva.com/16754/70201119-16754822.pdf; ComponentLink5URL: https://datasheet.ciiva.com/8337/dcrcwe3-8337738.pdf; ComponentLink5Description: https://datasheet.ciiva.com/8337/dcrcwe3-8337738.pdf; ComponentLink6URL: https://datasheet.ciiva.com/16341/dcrcwe3-16341530.pdf; ComponentLink6Description: https://datasheet.ciiva.com/16341/dcrcwe3-16341530.pdf; ComponentLink7URL: https://datasheet.ciiva.com/16852/dcrcwe3-16852810.pdf; ComponentLink7Description: https://datasheet.ciiva.com/16852/dcrcwe3-16852810.pdf; ComponentLink8URL: https://datasheet.ciiva.com/16720/70201119-16720891.pdf; ComponentLink8Description: https://datasheet.ciiva.com/16720/70201119-16720891.pdf; ComponentLink9URL: https://datasheet.ciiva.com/7777/1720486-7777565.pdf; ComponentLink9Description: https://datasheet.ciiva.com/7777/1720486-7777565.pdf
U15 = LT8570: Supplier 1: Digi-Key